# Altium schematic sheet PIC_BLOCK.SchDoc
size A3; ApprovedBy: D. Grossman; CheckedBy: G. Engel; Author: Y. Yakov; CompanyName: LightSense; DrawnBy: Y. Yakov; Engineer: Y.Yakov; Organization: LightSense
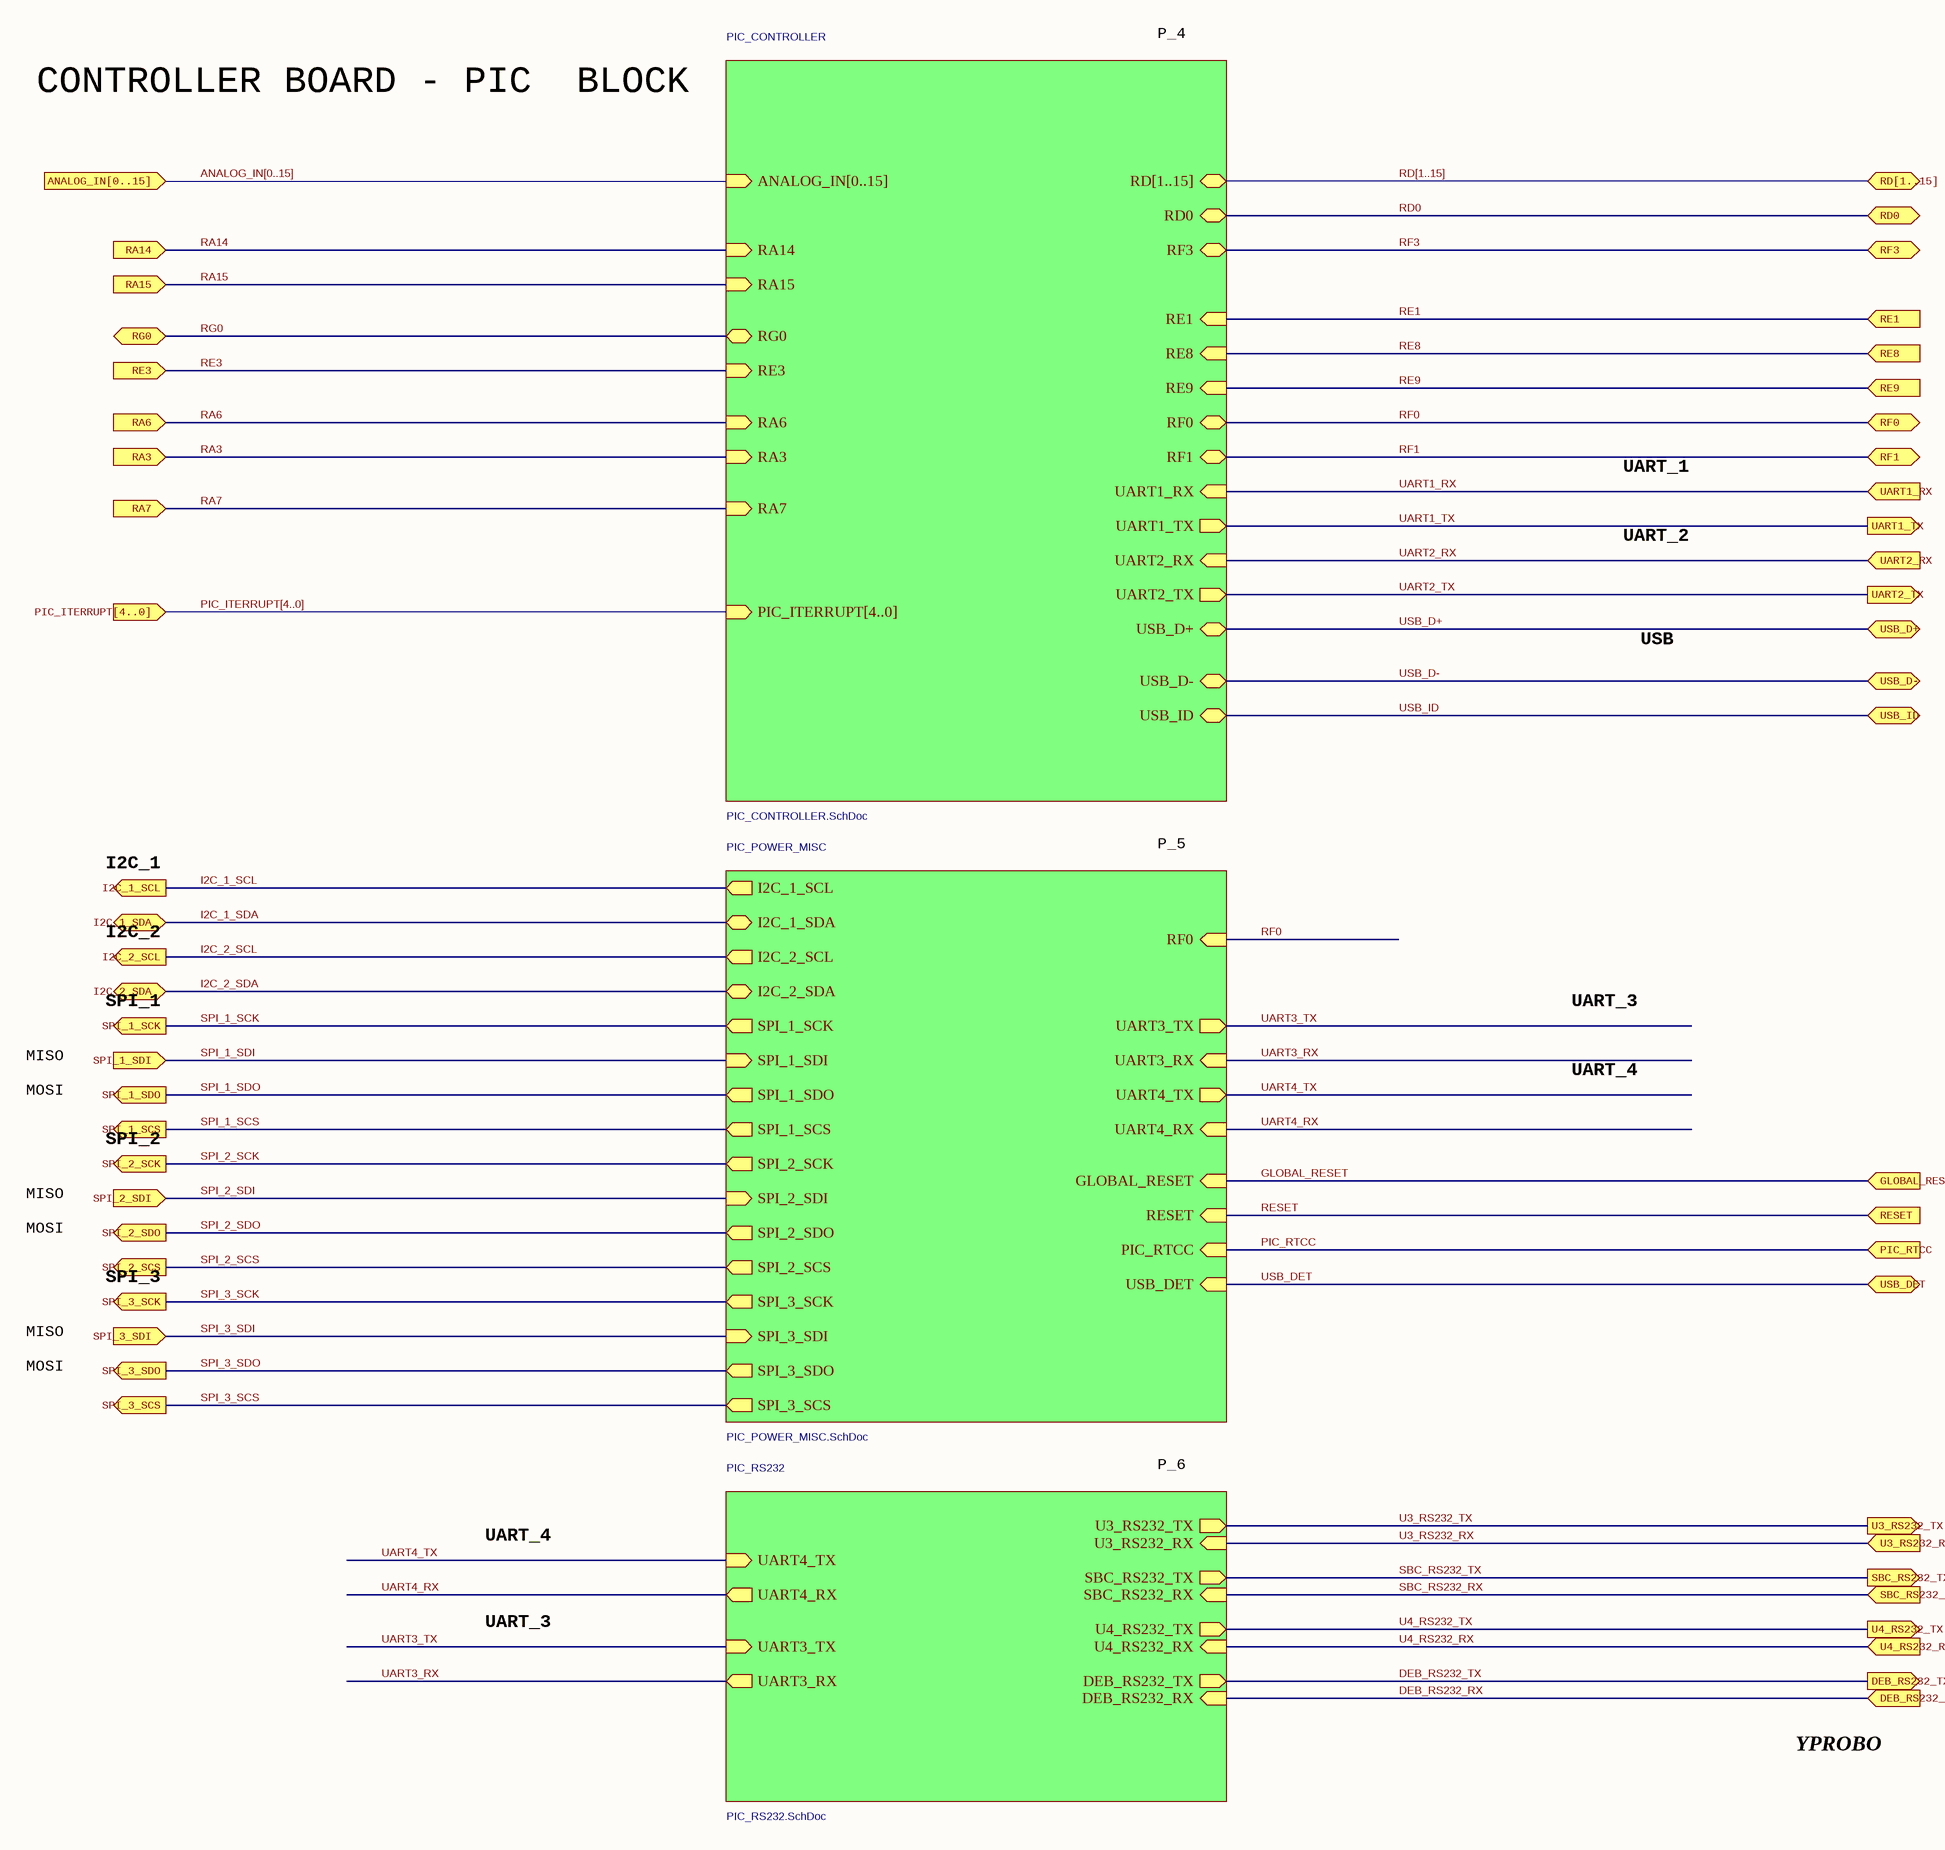
[diagram p0: PIC_BLOCK.SchDoc]

## Sub-sheets
PIC_CONTROLLER = PIC_CONTROLLER.SchDoc: RF0 (bidir), RF1 (bidir), RF3 (bidir), USB_ID (bidir), USB_D+ (bidir), USB_D- (bidir), RE1 (in), RE3 (in), RE8 (in), RE9 (in), RA6 (in), RA7 (in), RA3 (in), RA14 (in), RA15 (in), RD0 (bidir), PIC_ITERRUPT[4..0] (in), UART1_RX (in), UART2_RX (in), UART1_TX (out), UART2_TX (out), RG0 (bidir), ANALOG_IN[0..15] (in), RD[1..15] (bidir)
PIC_POWER_MISC = PIC_POWER_MISC.SchDoc: PIC_RTCC (in), GLOBAL_RESET (in), SPI_3_SDO (out), SPI_3_SCS (out), SPI_3_SDI (in), SPI_3_SCK (out), SPI_2_SDO (out), SPI_2_SCS (out), SPI_2_SDI (in), SPI_2_SCK (out), UART4_RX (in), UART4_TX (out), UART3_RX (in), UART3_TX (out), RESET (in), USB_DET (in), I2C_2_SDA (bidir), I2C_1_SDA (bidir), I2C_2_SCL (out), I2C_1_SCL (out), SPI_1_SDO (out), SPI_1_SCS (out), SPI_1_SDI (in), SPI_1_SCK (out), RF0 (in)
PIC_RS232 = PIC_RS232.SchDoc: SBC_RS232_TX (out), SBC_RS232_RX (in), DEB_RS232_TX (out), DEB_RS232_RX (in), UART4_RX (out), UART4_TX (in), UART3_RX (out), UART3_TX (in), U3_RS232_TX (out), U4_RS232_TX (out), U3_RS232_RX (in), U4_RS232_RX (in)

## Ports
ANALOG_IN[0..15] (in), DEB_RS232_RX (in), DEB_RS232_TX (out), GLOBAL_RESET (in), I2C_1_SCL (out), I2C_1_SDA (bidir), I2C_2_SCL (out), I2C_2_SDA (bidir), PIC_ITERRUPT[4..0] (in), PIC_RTCC (in), RA3 (in), RA6 (in), RA7 (in), RA14 (in), RA15 (in), RD0 (bidir), RD[1..15] (bidir), RE1 (in), RE3 (in), RE8 (in), RE9 (in), RESET (in), RF0 (bidir), RF1 (bidir), RF3 (bidir), RG0 (bidir), SBC_RS232_RX (in), SBC_RS232_TX (out), SPI_1_SCK (out), SPI_1_SCS (out), SPI_1_SDI (in), SPI_1_SDO (out), SPI_2_SCK (out), SPI_2_SCS (out), SPI_2_SDI (in), SPI_2_SDO (out), SPI_3_SCK (out), SPI_3_SCS (out), SPI_3_SDI (in), SPI_3_SDO (out), U3_RS232_RX (in), U3_RS232_TX (out), U4_RS232_RX (in), U4_RS232_TX (out), UART1_RX (in), UART1_TX (out), UART2_RX (in), UART2_TX (out), USB_D+ (bidir), USB_D- (bidir), USB_DET (bidir), USB_ID (bidir)

## Nets
DEB_RS232_RX: port DEB_RS232_RX, sheet PIC_RS232/DEB_RS232_RX
DEB_RS232_TX: port DEB_RS232_TX, sheet PIC_RS232/DEB_RS232_TX
GLOBAL_RESET: port GLOBAL_RESET, sheet PIC_POWER_MISC/GLOBAL_RESET
I2C_1_SCL: port I2C_1_SCL, sheet PIC_POWER_MISC/I2C_1_SCL
I2C_1_SDA: port I2C_1_SDA, sheet PIC_POWER_MISC/I2C_1_SDA
I2C_2_SCL: port I2C_2_SCL, sheet PIC_POWER_MISC/I2C_2_SCL
I2C_2_SDA: port I2C_2_SDA, sheet PIC_POWER_MISC/I2C_2_SDA
PIC_RTCC: port PIC_RTCC, sheet PIC_POWER_MISC/PIC_RTCC
RA3: port RA3, sheet PIC_CONTROLLER/RA3
RA6: port RA6, sheet PIC_CONTROLLER/RA6
RA7: port RA7, sheet PIC_CONTROLLER/RA7
RA14: port RA14, sheet PIC_CONTROLLER/RA14
RA15: port RA15, sheet PIC_CONTROLLER/RA15
RD0: port RD0, sheet PIC_CONTROLLER/RD0
RE1: port RE1, sheet PIC_CONTROLLER/RE1
RE3: port RE3, sheet PIC_CONTROLLER/RE3
RE8: port RE8, sheet PIC_CONTROLLER/RE8
RE9: port RE9, sheet PIC_CONTROLLER/RE9
RESET: port RESET, sheet PIC_POWER_MISC/RESET
RF0: port RF0, sheet PIC_CONTROLLER/RF0, sheet PIC_POWER_MISC/RF0
RF1: port RF1, sheet PIC_CONTROLLER/RF1
RF3: port RF3, sheet PIC_CONTROLLER/RF3
RG0: port RG0, sheet PIC_CONTROLLER/RG0
SBC_RS232_RX: port SBC_RS232_RX, sheet PIC_RS232/SBC_RS232_RX
SBC_RS232_TX: port SBC_RS232_TX, sheet PIC_RS232/SBC_RS232_TX
SPI_1_SCK: port SPI_1_SCK, sheet PIC_POWER_MISC/SPI_1_SCK
SPI_1_SCS: port SPI_1_SCS, sheet PIC_POWER_MISC/SPI_1_SCS
SPI_1_SDI: port SPI_1_SDI, sheet PIC_POWER_MISC/SPI_1_SDI
SPI_1_SDO: port SPI_1_SDO, sheet PIC_POWER_MISC/SPI_1_SDO
SPI_2_SCK: port SPI_2_SCK, sheet PIC_POWER_MISC/SPI_2_SCK
SPI_2_SCS: port SPI_2_SCS, sheet PIC_POWER_MISC/SPI_2_SCS
SPI_2_SDI: port SPI_2_SDI, sheet PIC_POWER_MISC/SPI_2_SDI
SPI_2_SDO: port SPI_2_SDO, sheet PIC_POWER_MISC/SPI_2_SDO
SPI_3_SCK: port SPI_3_SCK, sheet PIC_POWER_MISC/SPI_3_SCK
SPI_3_SCS: port SPI_3_SCS, sheet PIC_POWER_MISC/SPI_3_SCS
SPI_3_SDI: port SPI_3_SDI, sheet PIC_POWER_MISC/SPI_3_SDI
SPI_3_SDO: port SPI_3_SDO, sheet PIC_POWER_MISC/SPI_3_SDO
U3_RS232_RX: port U3_RS232_RX, sheet PIC_RS232/U3_RS232_RX
U3_RS232_TX: port U3_RS232_TX, sheet PIC_RS232/U3_RS232_TX
U4_RS232_RX: port U4_RS232_RX, sheet PIC_RS232/U4_RS232_RX
U4_RS232_TX: port U4_RS232_TX, sheet PIC_RS232/U4_RS232_TX
UART1_RX: port UART1_RX, sheet PIC_CONTROLLER/UART1_RX
UART1_TX: port UART1_TX, sheet PIC_CONTROLLER/UART1_TX
UART2_RX: port UART2_RX, sheet PIC_CONTROLLER/UART2_RX
UART2_TX: port UART2_TX, sheet PIC_CONTROLLER/UART2_TX
UART3_RX: sheet PIC_RS232/UART3_RX, sheet PIC_POWER_MISC/UART3_RX
UART3_TX: sheet PIC_RS232/UART3_TX, sheet PIC_POWER_MISC/UART3_TX
UART4_RX: sheet PIC_RS232/UART4_RX, sheet PIC_POWER_MISC/UART4_RX
UART4_TX: sheet PIC_RS232/UART4_TX, sheet PIC_POWER_MISC/UART4_TX
USB_D+: port USB_D+, sheet PIC_CONTROLLER/USB_D+
USB_D-: port USB_D-, sheet PIC_CONTROLLER/USB_D-
USB_DET: port USB_DET, sheet PIC_POWER_MISC/USB_DET
USB_ID: port USB_ID, sheet PIC_CONTROLLER/USB_ID

## Buses and harness runs
bus ANALOG_IN[0..15] = port ANALOG_IN[0..15] = sheet PIC_CONTROLLER/ANALOG_IN[0..15]
bus PIC_ITERRUPT[4..0] = port PIC_ITERRUPT[4..0] = sheet PIC_CONTROLLER/PIC_ITERRUPT[4..0]
bus RD[1..15] = port RD[1..15] = sheet PIC_CONTROLLER/RD[1..15]

## Notes on the sheet
- P_4
- CONTROLLER BOARD - PIC  BLOCK
- UART_1
- UART_2
- USB
- I2C_1
- P_5
- I2C_2
- MISO
- SPI_1
- UART_3
- UART_4
- MOSI
- SPI_2
- SPI_3
- P_6
- YPROBO
- Name
- Signature
- Date
- File:
- Board Name:
- Description:
- Document Version:
- Sheet
- of
- Approved
- Reviewed
- Designed
- This drawing and any accompanying documents contain confidential information intended for a specific individual and purpose.
  This information, owned by Lightsense, is private and confidential. If you are not the intended recipient, you are hereby notified that any disclosure, copying or distribution, or the taking of any action based on the contents of this information, is strictly prohibited.